# EAGLE design Touch_Shield (EAGLE 6.5.0)
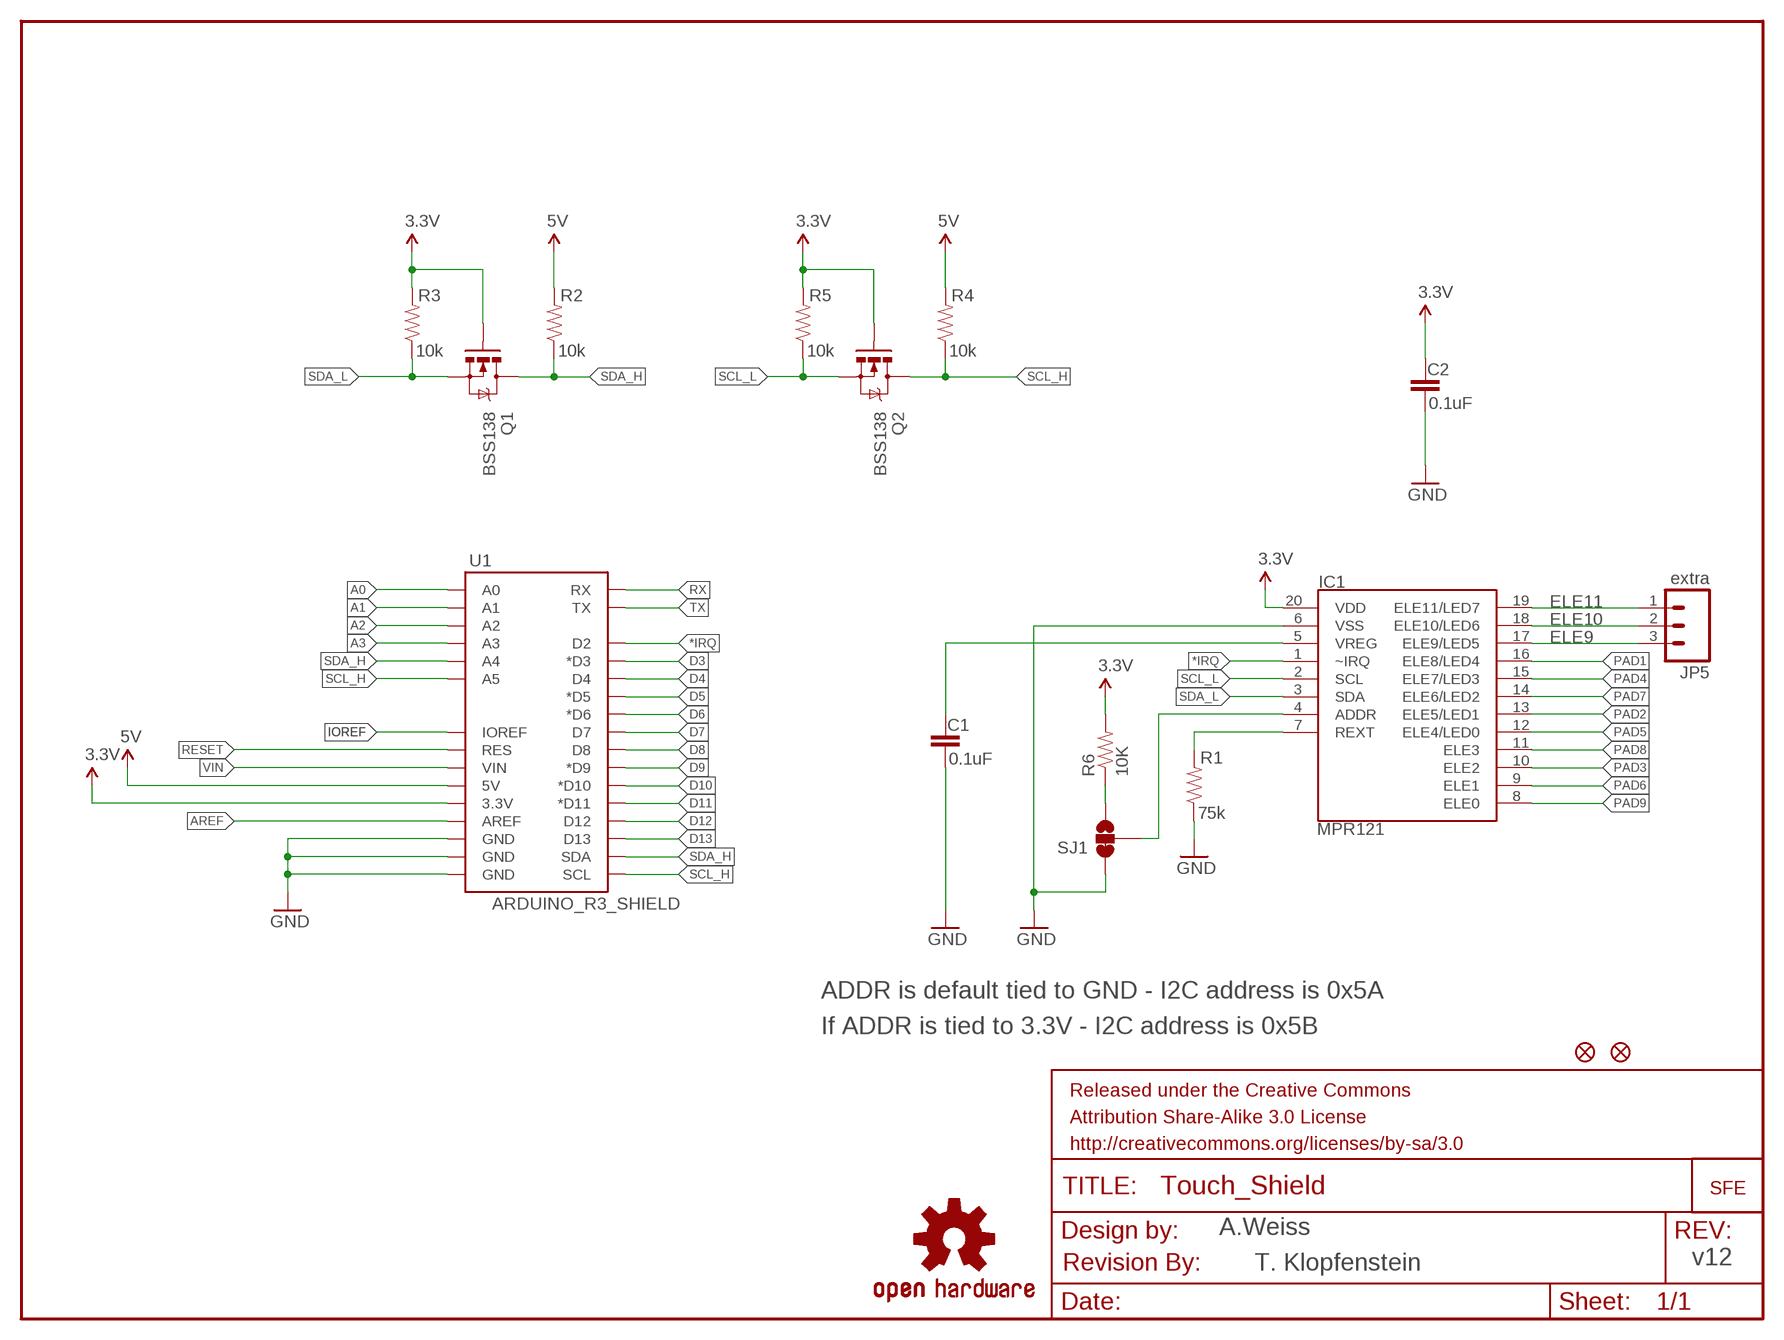
[diagram p0: schematic, sheet 1]

## Parts
C1  0.1uF  CAP0603-CAP  [0603-CAP]
C2  0.1uF  CAP0603-CAP  [0603-CAP]
FID1  FIDUCIALUFIDUCIAL  [MICRO-FIDUCIAL]
FID2  FIDUCIALUFIDUCIAL  [MICRO-FIDUCIAL]
FRAME1  FRAME-LETTER  [CREATIVE_COMMONS]
IC1  MPR121  MPR121V2  [QFN-20-0.4MM-V2]
JP1  LOGO-SFENEW  [SFE-NEW-WEBLOGO]
JP5  extra  M03PTH  [1X03]
Q1  BSS138  MOSFET-NCHANNELSMD  [SOT23-3]
Q2  BSS138  MOSFET-NCHANNELSMD  [SOT23-3]
R1  75k  RESISTOR0603-RES  [0603-RES]
R2  10k  10KOHM1/10W1%(0603)0603  [0603-RES]
R3  10k  10KOHM1/10W1%(0603)0603  [0603-RES]
R4  10k  10KOHM1/10W1%(0603)0603  [0603-RES]
R5  10k  10KOHM1/10W1%(0603)0603  [0603-RES]
R6  10K  10KOHM1/10W1%(0603)0603  [0603-RES]
SJ1  SOLDERJUMPER_2WAYPASTE1&2  [SJ_3_PASTE1&2]
U1  ARDUINO_R3_SHIELD  [UNO_R3_SHIELD]
U$1  REVISION  [REVISION]
U$5  OSHW-LOGOL  [OSHW-LOGO-L]

## Nets
3.3V: C2.1 IC1.20(VDD) Q1.1(G) Q2.1(G) R3.2 R5.2 R6.2 U1.3.3V
5V: R2.2 R4.2 U1.5V
*IRQ: IC1.1(~IRQ) U1.D2
A0: U1.A0
A1: U1.A1
A2: U1.A2
A3: U1.A3
AREF: U1.AREF
D3: U1.D3(*D3)
D4: U1.D4
D5: U1.D5(*D5)
D6: U1.D6(*D6)
D7: U1.D7
D8: U1.D8
D9: U1.D9(*D9)
D10: U1.D10(*D10)
D11: U1.D11(*D11)
D12: U1.D12
D13: U1.D13
ELE9: IC1.17(ELE9/LED5) JP5.3
ELE10: IC1.18(ELE10/LED6) JP5.2
ELE11: IC1.19(ELE11/LED7) JP5.1
GND: C1.2 C2.2 IC1.6(VSS) R1.1 SJ1.1 U1.GND@0(GND) U1.GND@1(GND) U1.GND@2(GND)
IOREF: U1.IOREF
N$1: IC1.4(ADDR) SJ1.2
N$2: R6.1 SJ1.3
PAD1: IC1.16(ELE8/LED4)
PAD2: IC1.13(ELE5/LED1)
PAD3: IC1.10(ELE2)
PAD4: IC1.15(ELE7/LED3)
PAD5: IC1.12(ELE4/LED0)
PAD6: IC1.9(ELE1)
PAD7: IC1.14(ELE6/LED2)
PAD8: IC1.11(ELE3)
PAD9: IC1.8(ELE0)
RESET: U1.RES
REXT: IC1.7(REXT) R1.2
RX: U1.RX
SCL_H: Q2.3(D) R4.1 U1.A5 U1.SCL
SCL_L: IC1.2(SCL) Q2.2(S) R5.1
SDA_H: Q1.3(D) R2.1 U1.A4 U1.SDA
SDA_L: IC1.3(SDA) Q1.2(S) R3.1
TX: U1.TX
VIN: U1.VIN
VREG: C1.1 IC1.5(VREG)

## Notes on the sheet
- ADDR is default tied to GND - I2C address is 0x5A
- If ADDR is tied to 3.3V - I2C address is 0x5B
- A.Weiss
- T. Klopfenstein | v12

## Library data of the parts
C1 C2 = SparkFun:CAP: Capacitor Standard 0603 ceramic capacitor, and 0.1" leaded capacitor.
FID1 FID2 = SparkFun-Aesthetics:FIDUCIAL: Fiducial Alignment Points Various fiducial points for machine vision alignment.
FRAME1 = SparkFun-Aesthetics:FRAME-LETTER: Schematic Frame Standard 8.5x11 US Letter frame
IC1 = SparkFun-Sensors:MPR121: MPR121 Capacitive Touch Sensor Controller. Variant "V2" was created using an image import of the bottom of the IC. It matches metal to metal.
JP1 = SparkFun:LOGO-SFE: Spark Fun Electronics PCB Logo This is the standard Spark Fun Electronics PCB logo.
JP5 = SparkFun:M03: Header 3 Standard 3-pin 0.1" header. Use with straight break away headers (SKU : PRT-00116), right angle break away headers (PRT-00553), swiss pins (PRT-00743), machine pins (PRT-00117), and female headers (PRT-00115). Molex polarized connector foot print use with SKU : PRT-08232 with associated crimp pins and housings.
Q1 Q2 = SparkFun:MOSFET-NCHANNEL
R1 = SparkFun:RESISTOR: Resistor Basic schematic elements and footprints for 0603, 1206, and PTH resistors.
R2-R5 = SparkFun-Resistors:10KOHM1/10W1%(0603): RES-00824; PROD_ID: RES-00824; VALUE: 10K
R6 = SparkFun-Resistors:10KOHM1/10W1%(0603): RES-00824; PROD_ID: RES-00824
SJ1 = SparkFun-Passives:SOLDERJUMPER_2WAY: Solder Jumper 2 way solder jumper
U1 = SparkFun-Boards:ARDUINO_R3_SHIELD: Shield form compatible with the Arduino Uno R3.
U$1 = SparkFun-Aesthetics:REVISION
U$5 = SparkFun-Aesthetics:OSHW-LOGO: Open Source Hardware Logo This logo indicates the piece of hardware it is found on incorporates a OSHW license and/or adheres to the definition of open source hardware found here: http://freedomdefined.org/OSHW

## Board
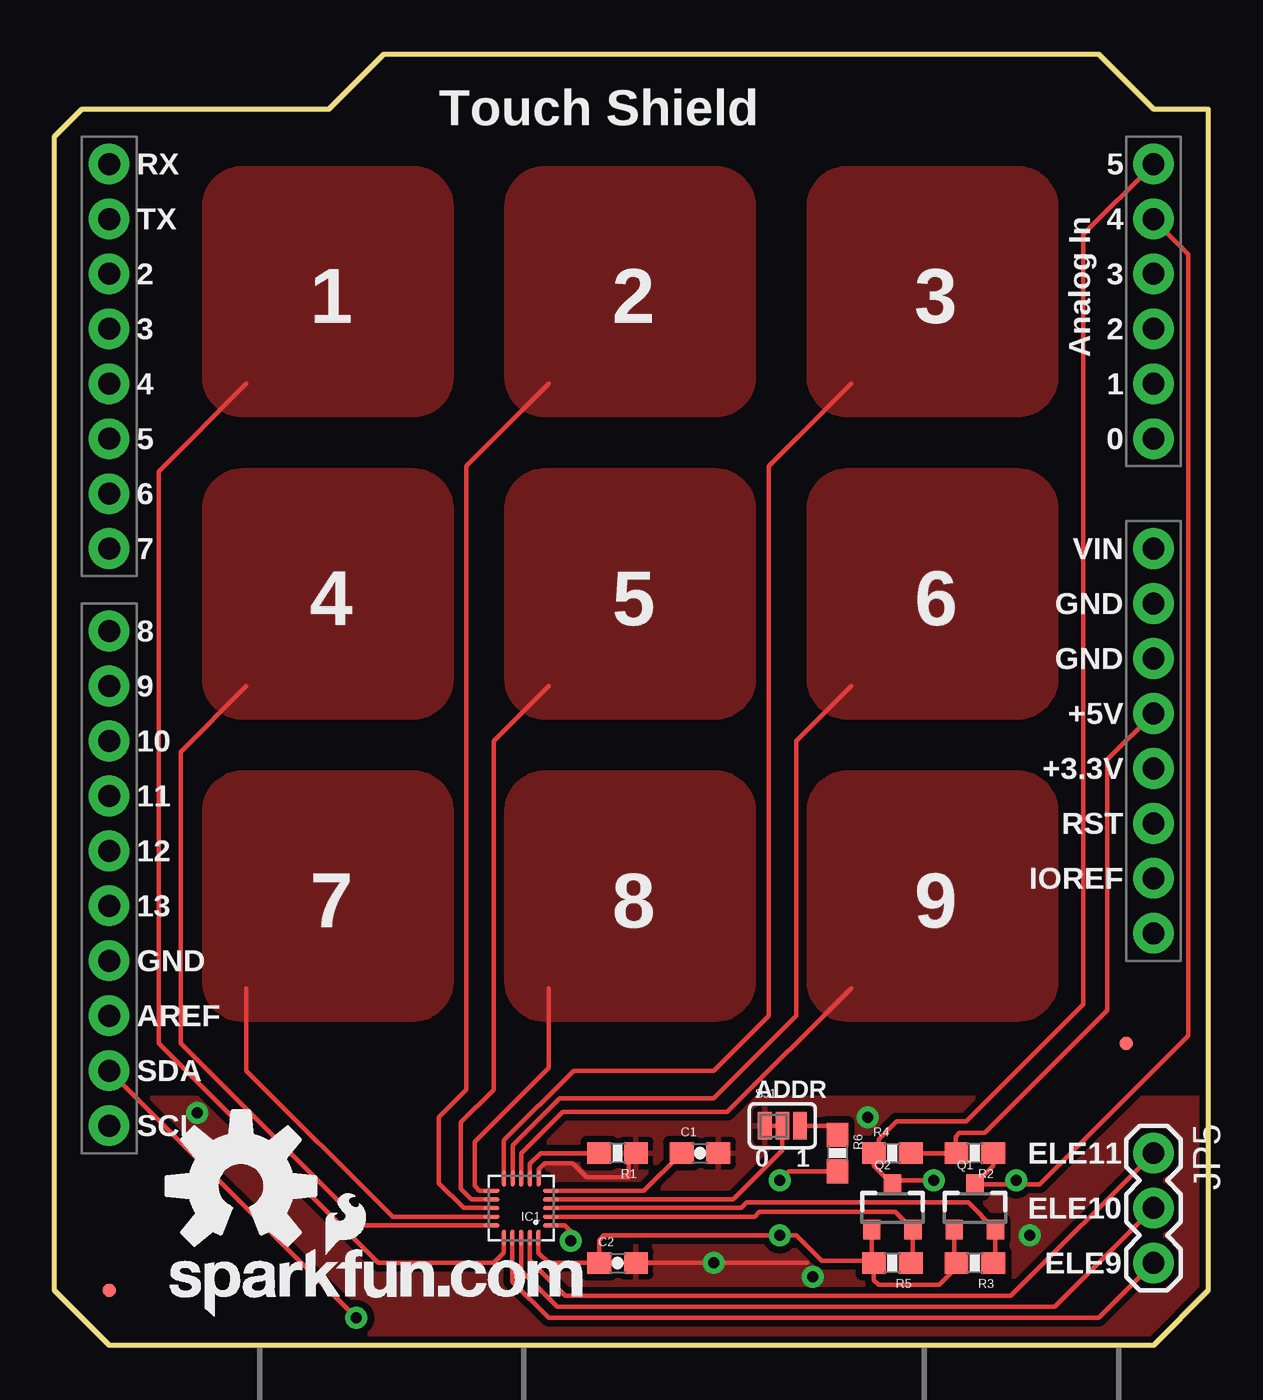
[diagram p1: board, top side]
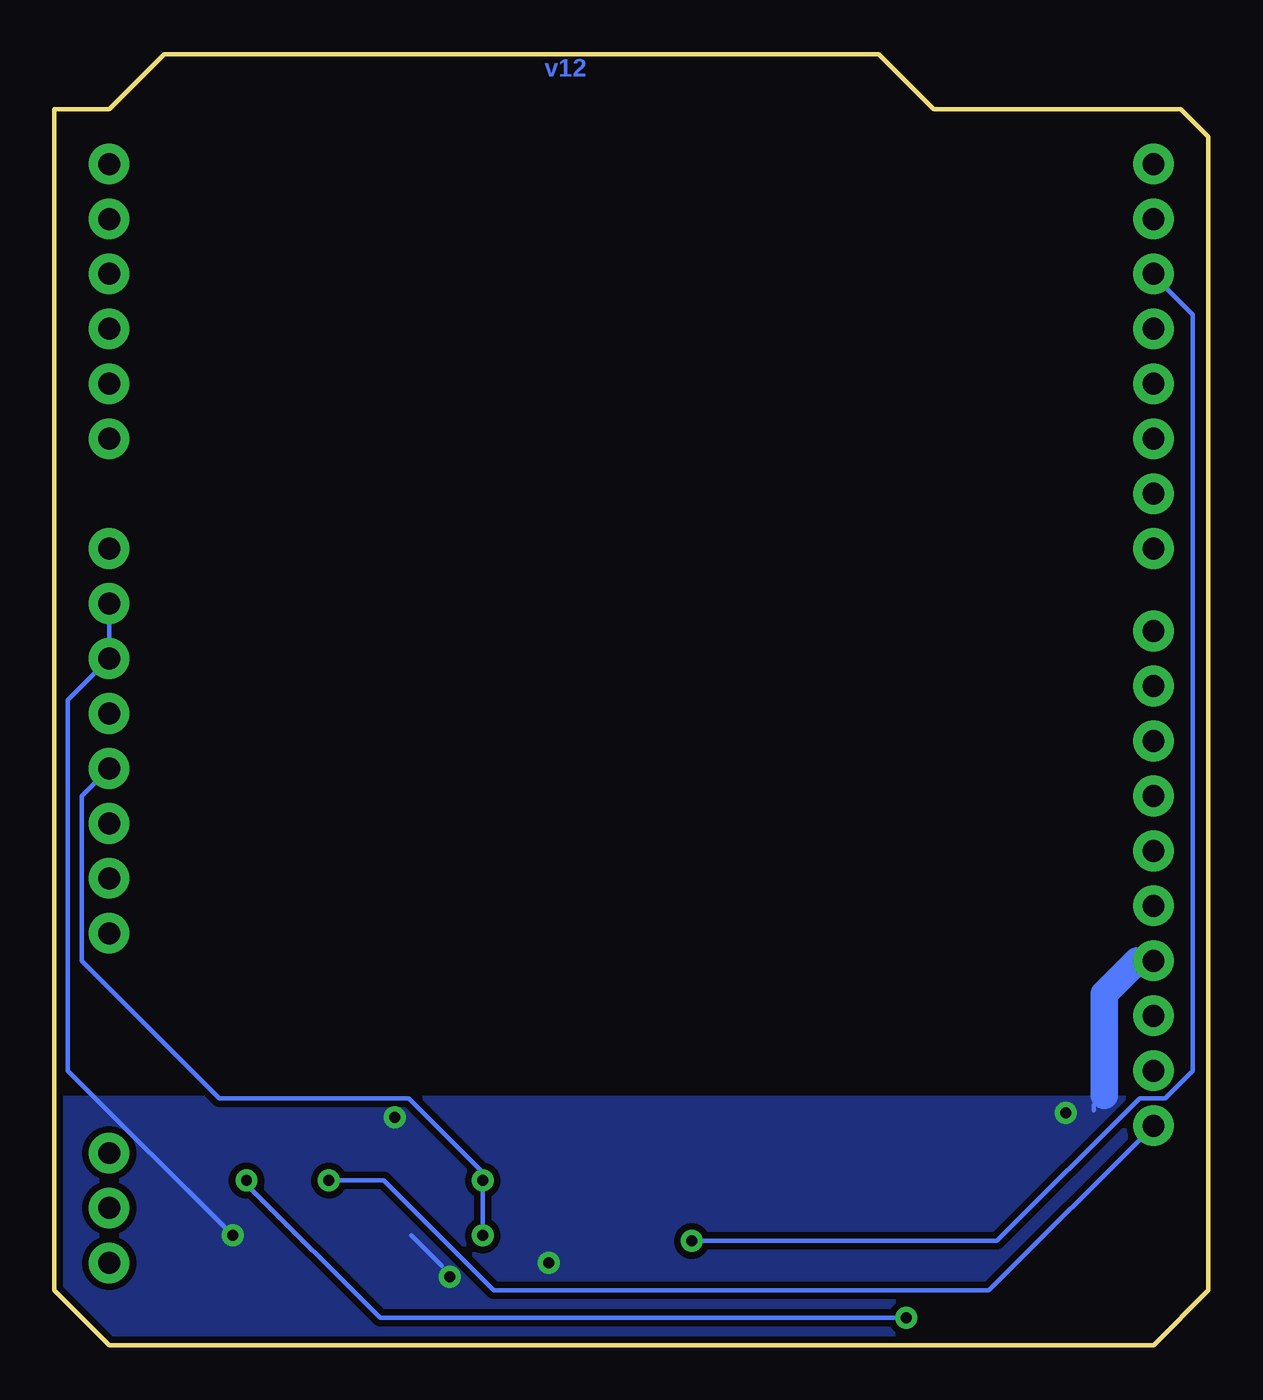
[diagram p2: board, bottom side, seen from below]

Size 53.34 x 59.69 mm. Coordinates in mm from the lower left corner, seen from the top.
Outline: 50.8,0 2.54,0 0,2.54 0,55.88 1.27,57.15 12.7,57.15 15.24,59.69 48.26,59.69 50.8,57.15 53.34,57.15 53.34,2.54 50.8,0
Copper layers (1*16): Top 0.035mm / dielectric 1.5mm / Bottom 0.035mm
Design rules "SparkFun *": minimum track width 8mil, minimum drill 20mil, track to track 8mil, track to pad 8mil, pad to pad 8mil, via to via 8mil, smd to smd 8mil, copper to edge 8mil, drill to drill 8mil, minimum pad ring 12mil, minimum via ring 10mil, stop-mask expansion 4mil, vias tented up to drill 20mil, thermal gap 10mil
tRestrict: area 22.7,7.7 to 22.7,7.7

### Footprints (pad centres in the part's own frame; a part is rotated, then mirrored left to right if it is on the bottom)
0603-CAP = smd 1.1 x 1: 1 -0.85,0; 2 0.85,0
MICRO-FIDUCIAL = smd 0.635 x 0.635: 1 0,0
QFN-20-0.4MM-V2 = smd 0.75 x 0.195: 1 -1.367,0.8; 2 -1.367,0.4; 3 -1.367,0; 4 -1.367,-0.4; 5 -1.367,-0.8; 11 1.375,-0.8; 12 1.375,-0.4; 13 1.375,0; 14 1.375,0.4; 15 1.375,0.8 | smd 0.195 x 0.75: 6 -0.795,-1.372; 7 -0.395,-1.372; 8 0.005,-1.372; 9 0.405,-1.372; 10 0.805,-1.372; 16 0.81,1.372; 17 0.41,1.372; 18 0.01,1.372; 19 -0.39,1.372; 20 -0.79,1.372
1X03 = drill 1.016 pad 1.88: 1 0,0; 2 2.54,0; 3 5.08,0
SOT23-3 = smd 0.8 x 0.9: 1 -0.95,-1; 2 0.95,-1; 3 0,1.1
0603-RES = smd 1.1 x 1: 1 -0.85,0; 2 0.85,0
SJ_3_PASTE1&2 = smd 0.635 x 1.27: 1 -0.813,0; 2 0,0; 3 0.813,0
UNO_R3_SHIELD = drill 1.016 pad 1.88: 3.3V 50.8,26.67; 5V 50.8,29.21; A0 50.8,41.91; A1 50.8,44.45; A2 50.8,46.99; A3 50.8,49.53; A4 50.8,52.07; A5 50.8,54.61; AREF 2.54,15.24; D2 2.54,49.53; D3 2.54,46.99; D4 2.54,44.45; D5 2.54,41.91; D6 2.54,39.37; D7 2.54,36.83; D8 2.54,33.02; D9 2.54,30.48; D10 2.54,27.94; D11 2.54,25.4; D12 2.54,22.86; D13 2.54,20.32; GND@0 50.8,31.75; GND@1 50.8,34.29; GND@2 2.54,17.78; IOREF 50.8,21.59; NC 50.8,19.05; RES 50.8,24.13; RX 2.54,54.61; SCL 2.54,10.16; SDA 2.54,12.7; TX 2.54,52.07; VIN 50.8,36.83

### Placement (x,y rotation side)
C1  29.84,8.89 0 top
C2  26.04,3.81 0 top
FID1  2.54,2.54 0 top
FID2  49.53,13.97 0 top
FRAME1  -4.34,-22.86 0 top  (outside the outline)
IC1  21.59,6.35 180 top
JP1  5.33,1.32 0 top
JP5  50.8,8.89 270 top
Q1  42.55,6.35 0 top
Q2  38.73,6.35 0 top
R1  26.04,8.89 180 top
R2  42.55,8.89 180 top
R3  42.55,3.81 180 top
R4  38.73,8.89 0 top
R5  38.73,3.81 180 top
R6  36.2,8.89 270 top
SJ1  33.66,10.16 0 top
U1  0,0 0 top
U$1  6.99,-25.4 0 top  (outside the outline)
U$5  8.64,7.37 0 top

### Tracks (layer width: path | path; a pad name or v marks a point on that pad's centre or on a via)
3.3V  (via drill 0.51)
  Top 0.203: 38.1,3.81 R5.2 | Q2.1 37.78,3.91 | 37.78,3.91 R5.2 | Q1.1 41.59,3.91 | 41.59,3.91 R3.2 | IC1.20 22.38,4.29 22.86,3.81 C2.1 25.18,4.87 25.4,5.08 v33.53,5.08 34.29,5.08 35.46,3.91 37.78,3.91 | R6.2 33.95,8.04 v33.53,7.62 | 41.59,3.91 41.59,3.5 40.89,2.79 38.1,2.79 37.88,3.01 R5.2
  Bottom 0.203: U1.3.3V 52.07,25.4 52.07,17.78 45.72,11.43 36.96,11.43 33.53,8 v33.53,7.62 v33.53,5.08
5V
  Top 0.203: R4.2 R2.2 41.66,8.93 41.66,9.65 41.83,9.83 43,9.83 48.67,15.49 48.67,27.08 U1.5V
*IRQ  (via drill 0.51)
  Top 0.203: IC1.1 23.6,5.55 23.96,5.18 23.96,4.92 v23.88,4.83
  Bottom 0.203: U1.D2 2.54,49.45 0.74,47.65 0.74,12.7 2.01,11.43 3.17,11.43 9.78,4.83 v23.88,4.83
ELE9
  Top 0.203: JP5.3 48.26,1.27 22.86,1.27 21.18,2.95 IC1.17
ELE10
  Top 0.203: JP5.2 46.23,1.78 23.24,1.78 21.58,3.44 IC1.18
ELE11
  Top 0.203: JP5.1 44.2,2.29 23.62,2.29 21.98,3.93 IC1.19
GND  (via drill 0.51)
  Top 0.203: IC1.6 22.39,8.14 22.67,8.42 23.96,8.42 24.61,7.77 26.56,7.77 26.56,8.56 R1.1 | C2.2 34.8,3.81 | SJ1.1 33.66,10.16
  Bottom 0.203: 5.3,10.87 5.3,11.09 4.83,11.56 | 35.43,3.68 36.83,5.08 | U1.GND@1 U1.GND@0 52.7,29.84 52.7,12.7 v45.09,5.08
  Bottom 1.27: U1.GND@2 3.3,17.78 4.83,16.26 4.83,11.56
  other vias: 6.6,10.74 30.48,3.81 37.59,10.54 35.05,3.17
  pour Bottom (isolate 0.305): 0,0 53.34,0 53.34,11.43 0,11.43
  pour Top (isolate 0.305): 0,11.43 0,0 53.34,0 53.34,11.43
N$1
  Top 0.203: IC1.4 31.39,6.75 33.66,9.02 SJ1.2
N$2
  Top 0.203: SJ1.3 35.77,10.16 R6.1
PAD1
  Top 0.203: 8.89,44.45 4.83,40.39 4.83,13.97 14.99,3.81 20.32,3.81 20.78,4.27 IC1.16
  pour Top (isolate 0.305): 6.93,44.79 arc90 8.73,42.99 16.57,42.99 arc90 18.36,44.79 18.36,52.63 arc90 16.57,54.42 8.73,54.42 arc90 6.93,52.63
PAD2
  Top 0.203: 22.86,44.45 19.05,40.64 19.05,11.81 17.78,10.54 17.78,7.49 18.92,6.35 IC1.13
  pour Top (isolate 0.305): 20.9,44.79 arc90 22.7,42.99 30.54,42.99 arc90 32.33,44.79 32.33,52.63 arc90 30.54,54.42 22.7,54.42 arc90 20.9,52.63
PAD3
  Top 0.203: 36.83,44.45 33.02,40.64 33.02,15.24 30.48,12.7 24,12.7 20.79,9.48 IC1.10
  pour Top (isolate 0.305): 34.87,44.79 arc90 36.67,42.99 44.51,42.99 arc90 46.3,44.79 46.3,52.63 arc90 44.51,54.42 36.67,54.42 arc90 34.87,52.63
PAD4
  Top 0.203: 8.89,30.48 5.84,27.43 5.84,13.97 14.26,5.55 IC1.15
  pour Top (isolate 0.305): 6.93,30.82 arc90 8.73,29.02 16.57,29.02 arc90 18.36,30.82 18.36,38.66 arc90 16.57,40.45 8.73,40.45 arc90 6.93,38.66
PAD5
  Top 0.203: 22.86,30.48 20.32,27.94 20.32,11.82 18.8,10.3 18.8,7.24 19.29,6.75 IC1.12
  pour Top (isolate 0.305): 20.9,30.82 arc90 22.7,29.02 30.54,29.02 arc90 32.33,30.82 32.33,38.66 arc90 30.54,40.45 22.7,40.45 arc90 20.9,38.66
PAD6
  Top 0.203: 36.83,30.48 34.29,27.94 34.29,15.24 30.48,11.43 23.37,11.43 21.18,9.25 IC1.9
  pour Top (isolate 0.305): 34.87,30.82 arc90 36.67,29.02 44.51,29.02 arc90 46.3,30.82 46.3,38.66 arc90 44.51,40.45 36.67,40.45 arc90 34.87,38.66
PAD7
  Top 0.203: 8.89,16.51 8.89,15.24 8.89,12.7 15.64,5.95 IC1.14
  pour Top (isolate 0.305): 6.93,16.85 arc90 8.73,15.05 16.57,15.05 arc90 18.36,16.85 18.36,24.69 arc90 16.57,26.48 8.73,26.48 arc90 6.93,24.69
PAD8
  Top 0.203: 22.86,16.51 22.86,12.84 19.43,9.41 19.43,7.37 19.65,7.15 IC1.11
  pour Top (isolate 0.305): 20.9,16.85 arc90 22.7,15.05 30.54,15.05 arc90 32.33,16.85 32.33,24.69 arc90 30.54,26.48 22.7,26.48 arc90 20.9,24.69
PAD9
  Top 0.203: IC1.8 21.59,8.88 23.5,10.79 31.11,10.79 36.83,16.51
  pour Top (isolate 0.305): 34.87,16.85 arc90 36.67,15.05 44.51,15.05 arc90 46.3,16.85 46.3,24.69 arc90 44.51,26.48 36.67,26.48 arc90 34.87,24.69
REXT
  Top 0.203: R1.2 22.48,8.89 21.98,8.4 IC1.7
SCL_H  (via drill 0.51)
  Top 0.203: U1.A5 47.55,51.36 47.55,15.77 42.14,10.36 38.94,10.36 38.1,9.53 38.1,9.11 R4.1 37.88,8.3 Q2.3 38.91,7.62 v40.64,7.62
  Bottom 0.203: v40.64,7.62 38.1,7.62 33.02,2.54 10.16,2.54 U1.SCL
SCL_L
  Top 0.203: IC1.2 32.37,5.95 32.59,6.17 38.86,6.17 Q2.2 39.69,3.91 R5.1
SDA_H  (via drill 0.51)
  Top 0.203: U1.A4 50.8,52.05 52.4,50.44 52.4,14.3 45.54,7.44 44.45,7.44 | 43.19,7.44 44.45,7.44 | U1.SDA v13.97,1.27 | 44.45,7.44 v44.45,7.62 44.28,7.45 Q1.3 43.4,8.3 R2.1
  Bottom 0.203: v13.97,1.27 38.28,1.27 44.45,7.44 v44.45,7.62
SDA_L
  Top 0.203: IC1.3 31.75,6.35 32,6.6 42.24,6.6 Q1.2 43.49,3.91 R3.1
VREG
  Top 0.203: IC1.5 27.25,7.15 C1.1

### Text on the board
Bottom: v12
tPlace: Touch Shield | 1 | 2 | 3 | 4 | 5 | 6 | 7 | 8 | 9 | ADDR | ELE11 | 0 | 1 | ELE10 | ELE9
Document: A. Weiss | T. Klopfenstein